# EAGLE design LispStar (EAGLE 7.6.0)

## Sheet 1 of 2
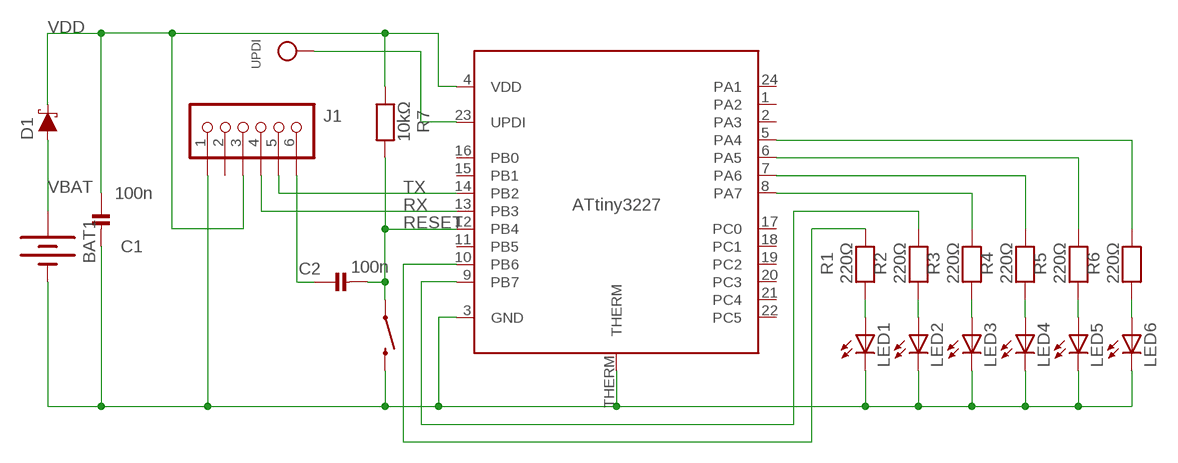
[diagram p0: schematic, sheet 1]

### Parts
BAT1  BATTERY12MM  [BATTCON_12MM]
C1  100n  CAP_CERAMIC_0805MP  [_0805MP]
C2  100n  CAP_CERAMIC_0805MP  [_0805MP]
D1  3A/10V/280mV  DIODE-SCHOTTKY-BAT60A  [SOD-323]
J1  AVR_SPI_PRG_6LINETESTPOINTS  [2X3_TEST_POINTS]
LED1  LEDCHIPLED_0805  [CHIPLED_0805]
LED2  LEDCHIPLED_0805  [CHIPLED_0805]
LED3  LEDCHIPLED_0805  [CHIPLED_0805]
LED4  LEDCHIPLED_0805  [CHIPLED_0805]
LED5  LEDCHIPLED_0805  [CHIPLED_0805]
LED6  LEDCHIPLED_0805  [CHIPLED_0805]
R1  220Ω  RESISTOR_0805MP  [_0805MP]
R2  220Ω  RESISTOR_0805MP  [_0805MP]
R3  220Ω  RESISTOR_0805MP  [_0805MP]
R4  220Ω  RESISTOR_0805MP  [_0805MP]
R5  220Ω  RESISTOR_0805MP  [_0805MP]
R6  220Ω  RESISTOR_0805MP  [_0805MP]
R7  10kΩ  RESISTOR_0805MP  [_0805MP]
S2  SWITCH-MOMENTARY-2SMD  [TACTILE-SWITCH-SMD]
U1  ATtiny3227  ATTINY3227  [QFN24_4MM]
UPDI  TESTPOINTROUND1MM  [TESTPOINT_ROUND_1MM]

### Nets
GND: BAT1.GND(-) C1.2 J1.1 LED1.C LED2.C LED3.C LED4.C LED5.C LED6.C S2.3 U1.3(GND) U1.THERM
N$2: U1.23(UPDI) UPDI.P$1
N$3: LED2.A R2.1
N$4: LED1.A R1.1
N$5: LED3.A R3.1
N$8: C2.1 J1.6
N$9: LED4.A R4.1
N$11: LED5.A R5.1
N$12: LED6.A R6.1
N$15: R6.2 U1.5(PA4)
N$16: R5.2 U1.6(PA5)
N$17: R4.2 U1.7(PA6)
N$18: R3.2 U1.8(PA7)
N$19: R2.2 U1.9(PB7)
N$20: R1.2 U1.10(PB6)
RESET: C2.2 R7.1 S2.1 U1.12(PB4)
RX: J1.4 U1.13(PB3)
TX: J1.5 U1.14(PB2)
VBAT: BAT1.PWR@1(+) D1.A
VDD: C1.1 D1.C J1.3 R7.2 U1.4(VDD)
Unconnected: J1.2 U1.1(PA2) U1.2(PA3) U1.11(PB5) U1.15(PB1) U1.16(PB0) U1.17(PC0) U1.18(PC1) U1.19(PC2) U1.20(PC3) U1.21(PC4) U1.22(PC5) U1.24(PA1)

## Sheet 2 of 2

## Library data of the parts
BAT1 = SparkFun-Electromechanical:BATTERY: Battery Holders Various common sizes : AA, AAA, 18650 (PRT-12895), 20mm coin cell and 12mm coin cell. 20MM_4LEGS, BATT-10373; PROD_ID: BATT-08044
C1 C2 = microbuilder:CAP_CERAMIC: Ceramic Capacitors 0402 - 0402 Surface Mount Capacitors 16pF 50V 5% [Digikey: 445-4899-2-ND] 18pF 50V 5% [Digikey: 490-1281-2-ND] 22pF 50V 5% [Digikey: 490-1283-2-ND] 68pF 50V 5% [Digikey: 490-1289-2-ND] 0.1uF 10V 10% [Digikey: 490-1318-2-ND] 1.0uF 6.3V 10% [Digikey: 490-1320-2-ND] 0603 - 0603 Surface Mount Capacitors 16 pF 50V 5% [Digikey: 445-5051-2-ND] 22 pF 50V [Digikey: PCC220ACVTR-ND] 33 pF 50V 5% [Digikey: 490-1415-1-ND] 56pF 50V 5% [Digikey: 490-1421-1-ND] 220pF 50V 5% [Digikey: 445-1285-1-ND] 680 pF 50V 2200 pF 50V 5% C0G [Digikey: 445-1297-1-ND] 5600 pF 100V 5% X7R [Digikey: 478-3711-1-ND] 0.1 µF 25V 10% [Digikey: PCC2277TR-ND] 0.22 µF 16V 10% X7R [Digikey: 445-1318-1-ND] 1.0 µF 25V 10% [Digikey: 445-5146-2-ND] 0603 - RF Specific 3pF 250V +/-0.1pF RF [Digikey: 712-1347-1-ND] 18 pF 250V 5% [Digikey: 478-3505-1-ND or 712-1322-1-ND] 56 pF 250V 5% C0G RF [Digikey: 490-4867-1-ND] 68 pF 250V RF [Digikey: 490-4868-1-ND] 0805 - 0805 Surface Mount Capacitors 220 pF 250V 2% RF Ceramic Capacitor [Digikey: 712-1398-1-ND] 1000 pF 50V 2% NP0 Ceramic Capacitor [Digikey: 478-3760-1-ND] 0.1 µF 25V 10% Ceramic Capacitor [Digikey: PCC1828TR-ND] 1.0 µF 16V 10% Ceramic Capacitor[Digikey: 490-1691-2-ND] 10.0 µF 10V 10% Ceramic Capacitor[Digikey: 709-1228-1-ND] 10.0 uF 16V 10% Ceramic Capacitor [Digikey: 478-5165-2-ND] 47 uF 6.3V 20% Ceramic Capacitor [Digikey: 587-1779-1-ND or 399-5506-1-ND] 1206 - 1206 Surface Mount Capacitors 47uF 10V 20% Ceramic Capacitor [Digikey: 490-5528-1-ND or 399-5508-1-ND or 445-6010-1-ND] 100uF 6.3V -20%, +80% Y5V Ceramic Capacitor (Digikey: 490-4512-1-ND, Mouser: 81-GRM31CF50J107ZE1L)
D1 = SparkFun-DiscreteSemi:DIODE-SCHOTTKY: Schottky diode A Schottky diode is a semiconductor diode which has a low forward voltage drop and a very fast switching action.; PROD_ID: DIO-14072
J1 = technoblogy:AVR_SPI_PRG_6LINE: AVR ISP 6 Pin This is the reduced ISP connector for AVR programming. Common on Arduino. This footprint will take up less PCB space and can be used with a 10-pin to 6-pin adapter such as SKU: BOB-08508 **Special note about "TEST_POINT" package. The stop mask is on the top side, so if you want your programming test points to be on the bottom of your board, make sure to place this package on the bottom side of the board. This also ensure that the orientation to program from the bottom side will be correct.
LED1-LED6 = adafruit:LED: LED OSRAM: - CHIPLED LG R971, LG N971, LY N971, LG Q971, LY Q971, LO R971, LY R971 LH N974, LH R974 LS Q976, LO Q976, LY Q976 LO Q996 - Hyper CHIPLED LW Q18S LB Q993, LB Q99A, LB R99A - SideLED LS A670, LO A670, LY A670, LG A670, LP A670 LB A673, LV A673, LT A673, LW A673 LH A674 LY A675 LS A676, LA A676, LO A676, LY A676, LW A676 LS A679, LY A679, LG A679 - Hyper Micro SIDELED® LS Y876, LA Y876, LO Y876, LY Y876 LT Y87S - SmartLED LW L88C, LW L88S LB L89C, LB L89S, LG L890 LS L89K, LO L89K, LY L89K LS L896, LA L896, LO L896, LY L896 - TOPLED LS T670, LO T670, LY T670, LG T670, LP T670 LSG T670, LSP T670, LSY T670, LOP T670, LYG T670 LG T671, LOG T671, LSG T671 LB T673, LV T673, LT T673, LW T673 LH T674 LS T676, LA T676, LO T676, LY T676, LB T676, LH T676, LSB T676, LW T676 LB T67C, LV T67C, LT T67C, LS T67K, LO T67K, LY T67K, LW E67C LS E67B, LA E67B, LO E67B, LY E67B, LB E67C, LV E67C, LT E67C LW T67C LS T679, LY T679, LG T679 LS T770, LO T770, LY T770, LG T770, LP T770 LB T773, LV T773, LT T773, LW T773 LH T774 LS E675, LA E675, LY E675, LS T675 LS T776, LA T776, LO T776, LY T776, LB T776 LHGB T686 LT T68C, LB T68C - Hyper Mini TOPLED® LB M676 - Mini TOPLED Santana® LG M470 LS M47K, LO M47K, LY M47K Source: http://www.osram.convergy.de/
R1-R7 = microbuilder:RESISTOR: Resistors 0402 - 0402 Surface Mount Package 22 Ohm 1% 1/16W [Digikey: 311-22.0LRTR-ND] 33 Ohm 5% 1/16W 1.0K 5% 1/16W 1.5K 5% 1/16W 2.0K 1% 1/16W 10.0K 1% 1/16W [Digikey: 311-10.0KLRTR-ND] 10.0K 5% 1/16W [Digikey: RMCF0402JT10K0TR-ND] 12.1K 1% 1/16W [Digikey: 311-22.0LRTR-ND] 100.0K 5% 1/16W 0603 - 0603 Surface Mount Package 0 Ohm 1/10 Watt 1% Resistor 15 Ohm 1/10 Watt 1% Resistor 33 Ohm 1/10 Watt 1% Resistor 49.9 Ohm 1/10 Watt 1% Resistor 100 Ohm 1/10 Watt 1% Resistor 150 Ohm 1/10 Watt 1% Resistor 240 Ohm 1/10 Watt 1% Resistor 390 Ohm 1/10 Watt 1% Resistor 560 Ohm 1/10 Watt 1% Resistor 680 Ohm 1/10 Watt 1% Resistor 750 Ohm 1/10 Watt 1% Resistor 1.0K Ohm 1/10 Watt 1% Resistor 1.5K Ohm 1/10 Watt 1% Resistor 2.0K Ohm 1/10 Watt 1% Resistor 2.2K Ohm 1/10 Watt 1% Resistor 3.3K Ohm 1/10 Watt 1% Resistor 4.7K Ohm 1/10 Watt 1% Resistor 10.0K Ohm 1/10 Watt 1% Resistor 12.0K Ohm 1/10 Watt 1% Resistor 12.1K Ohm 1/10 Watt 1% Resistor 20.0K Ohm 1/10 Watt 1% Resistor 33.0K Ohm 1/10 Watt 1% Resistor 100.0K Ohm 1/10 Watt 1% Resistor 0805 - 0805 Surface Mount Package 0 Ohm 1/8 Watt 1% Resistor 33 Ohm 1/8 Watt 1% Resistor 100 Ohm 1/8 Watt 1% Resistor 150 Ohm 1/8 Watt 1% Resistor 200 Ohm 1/8 Watt 1% Resistor 240 Ohm 1/8 Watt 1% Resistor 330 Ohm 1/8 Watt 1% Resistor 390 Ohm 1/8 Watt 1% Resistor 470 Ohm 1/8 Watt 1% Resistor 1.0K Ohm 1/8 Watt 1% Resistor 1.5K Ohm 1/8 Watt 1% Resistor 2.0K Ohm 1/8 Watt 1% Resistor 4.7K Ohm 1/8 Watt 1% Resistor 5.1K Ohm 1/8 Watt 1% Resistor 5.6K Ohm 1/8 Watt 1% Resistor 10.0K Ohm 1/8 Watt 1% Resistor 22.0K Ohm 1/8 Watt 1% Resistor 33.0K Ohm 1/8 Watt 1% Resistor 100K Ohm 1/8 Watt 1% Resistor 1206 - 1206 Surface Mount Package 2012 - 2010 Surface Mount Package 0.11 Ohm 1/2 Watt 1% Resistor - Digikey: RHM.11UCT-ND
S2 = SparkFun-Electromechanical:SWITCH-MOMENTARY-2: Various NO switches- pushbuttons, reed, etc; PROD_ID: SWCH-08247
U1 = technoblogy:ATTINY3227: ATtiny3227
UPDI = microbuilder:TESTPOINT: Test Point Various test points for characterisation and PCB testing TESTPOINT_SMT - Compact Surface Mount Test Point [Digikey: 5016KTR-ND]

## Net classes
0 default: width 0.152 mm, drill 0.305 mm, clearance 0.152 mm

## Board
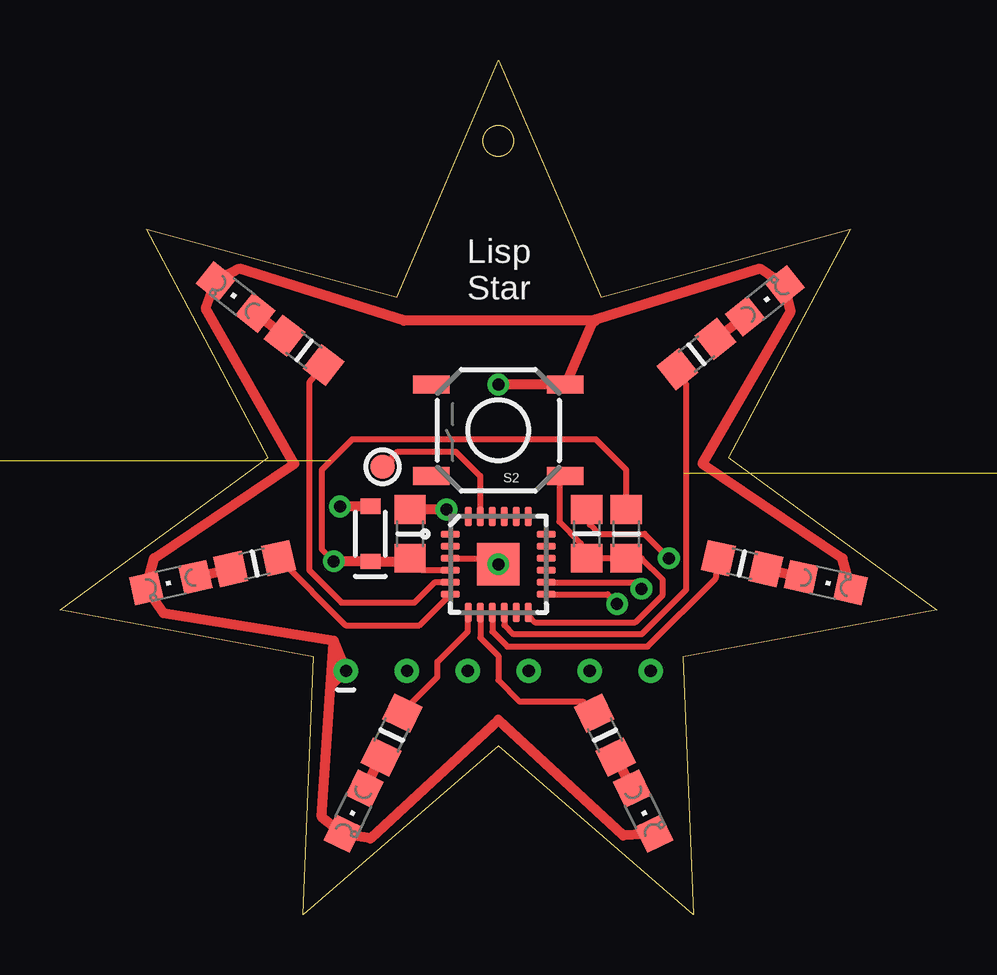
[diagram p1: board, top side]
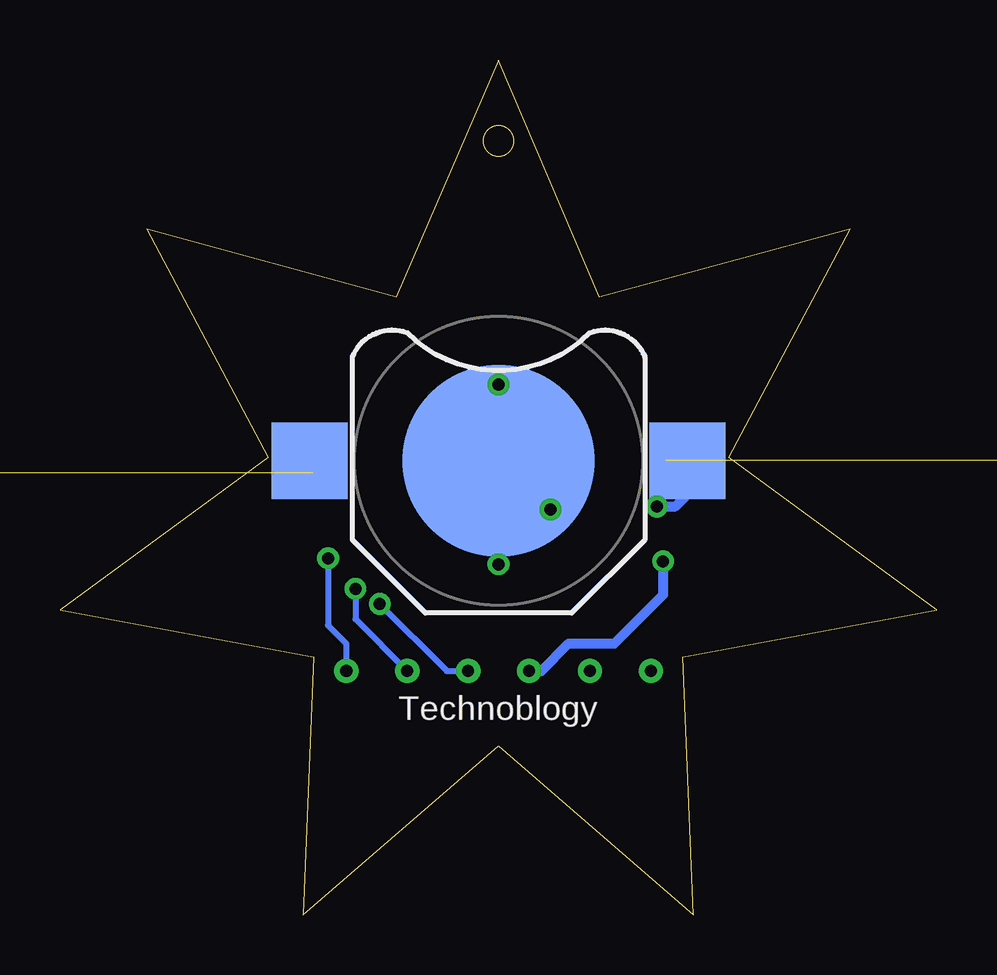
[diagram p2: board, bottom side, seen from below]

Size 36.56 x 35.64 mm. Coordinates in mm from the lower left corner, seen from the top.
Outline: 10.14,0 10.58,10.75 0,12.72 8.68,19.08 3.62,28.58 14.06,25.75 18.28,35.64 22.55,25.75 32.94,28.58 27.87,19.08 36.56,12.72 25.98,10.75 26.42,0 18.27,7.04 10.14,0
Outline: circle at 18.27,32.27 radius 0.64
Copper layers (1*16): Top 0.035mm / dielectric 1.5mm / Bottom 0.035mm
Design rules "default *": minimum track width 10mil, minimum drill 24mil, track to track 8mil, track to pad 8mil, pad to pad 8mil, via to via 8mil, smd to smd 8mil, copper to edge 40mil, drill to drill 8mil, minimum pad ring 10mil, minimum via ring 8mil, stop-mask expansion 4mil, vias tented up to drill 20mil, thermal gap 10mil

### Footprints (pad centres in the part's own frame; a part is rotated, then mirrored left to right if it is on the bottom)
BATTCON_12MM = smd 8 x 8: GND 0,0 | smd 3.175 x 3.175: PWR@1 -7.874,0; PWR@2 7.874,0
_0805MP = smd 1.2 x 1.3: 1 -1.016,0; 2 1.016,0
SOD-323 = smd 0.63 x 0.83: A 1.15,0; C -1.15,0
2X3_TEST_POINTS = drill 0.508: 1 -6.35,0; 2 -3.81,0; 3 -1.27,0; 4 1.27,0; 5 3.81,0; 6 6.35,0
CHIPLED_0805 = smd 1.2 x 1.2: A 0,-1.05; C 0,1.05
TACTILE-SWITCH-SMD = smd 1.524 x 0.762: 1 -2.794,1.905; 2 2.794,1.905; 3 -2.794,-1.905; 4 2.794,-1.905
QFN24_4MM = smd 0.8 x 0.28: 1 -2,1.25; 2 -2,0.75; 3 -2,0.25; 4 -2,-0.25; 5 -2,-0.75; 6 -2,-1.25; 13 2,-1.25; 14 2,-0.75; 15 2,-0.25; 16 2,0.25; 17 2,0.75; 18 2,1.25 | smd 0.28 x 0.8: 7 -1.25,-2; 8 -0.75,-2; 9 -0.25,-2; 10 0.25,-2; 11 0.75,-2; 12 1.25,-2; 19 1.25,2; 20 0.75,2; 21 0.25,2; 22 -0.25,2; 23 -0.75,2; 24 -1.25,2 | smd 1.778 x 1.778: THERM 0,0
TESTPOINT_ROUND_1MM = smd 1 x 1: P$1 0,0

### Placement (x,y rotation side)
BAT1  18.27,18.94 0 bottom
C1  14.59,15.89 90 top
C2  21.96,15.89 270 top
D1  12.94,15.89 90 top
J1  18.27,10.17 0 top
LED1  29.39,25.6 308.5 top
LED2  31.93,13.86 257.2 top
LED3  24.31,4.33 205.8 top
LED4  12.24,4.33 154.2 top
LED5  4.62,13.86 102.8 top
LED6  7.32,25.76 51.4 top
R1  26.53,23.38 218.5 top
R2  28.43,14.65 167.2 top
R3  22.72,7.51 115.8 top
R4  13.83,7.51 64.2 top
R5  8.11,14.65 12.8 top
R6  10.18,23.54 322.5 top
R7  23.61,15.89 90 top
S2  18.27,20.21 180 top
U1  18.27,14.62 0 top
UPDI  13.45,18.68 0 top

### Tracks (layer width: path | path; a pad name or v marks a point on that pad's centre or on a via)
GND  (via drill 0.5)
  Top 0.178: 18.64,14.22 U1.THERM | 11.5,10.3 11.33,10.13
  Top 0.254: U1.3 17.52,14.87 17.64,14.74 | 17.64,14.74 17.89,14.74 18.27,15.13 | 17.64,13.86 18.27,14.49 U1.THERM 17.77,14.62 17.64,14.74
  Top 0.406: 11.29,9.55 10.91,4.08 LED4.C 12.94,3.19 18.27,8.14 23.48,3.31 LED3.C | 11.29,9.55 11.33,10.13 11.42,11.32 | v16.11,16.9 C1.2 | 22.34,24.78 22.21,24.78 | 22.21,24.78 14.34,24.78 7.48,26.94 LED6.C 6.08,25.29 9.76,18.81 3.92,14.87 LED5.C 4.3,12.59 11.42,11.44 J1.1 11.29,9.55 | 22.21,24.78 29.2,26.94 LED1.C 30.47,25.16 26.78,18.81 32.62,14.87 LED2.C | 22.21,24.78 S2.3 v18.27,22.11
  Bottom 0.178: v18.27,22.11 BAT1.GND
  Bottom 0.254: 16.5,15.51 v16.11,16.9
  Bottom 0.406: U1.THERM 18.27,16.4 | 18.27,16.4 BAT1.GND | 18.27,16.4 16.11,16.4 v16.11,16.9
  other vias: 18.27,14.62
N$2
  Top 0.254: U1.23 17.51,16.63 17.51,18.3 16.5,19.32 14.08,19.32 13.83,19.06 13.83,18.94 13.57,18.68 UPDI.P$1
N$3
  Top 0.406: R2.1 LED2.A
N$4
  Top 0.406: LED1.A R1.1
N$5
  Top 0.406: R3.1 LED3.A
N$8  (via drill 0.5)
  Top 0.254: v25.39,14.87 24.37,15.89 22.46,15.89 22.08,16.27 C2.1
  Bottom 0.254: v25.39,14.87 25.39,12.08 24.62,11.32 J1.6
N$9
  Top 0.406: R4.1 LED4.A
N$11
  Top 0.406: LED5.A R5.1
N$12
  Top 0.406: LED6.A R6.1
N$15
  Top 0.178: 10.65,23.25 R6.2
  Top 0.254: U1.5 15.61,13.86 14.77,13.02 11.74,13.02 10.4,14.36 10.4,22.21 R6.2
N$16
  Top 0.254: R5.2 11.9,12.08 14.98,12.08 U1.6
N$17
  Top 0.254: R4.2 14.27,8.46 15.73,9.92 15.73,10.55 17,11.82 17,12.6 U1.7
N$18
  Top 0.254: U1.8 17.52,11.56 18.27,10.81 18.27,9.79 19.16,8.9 21.79,8.9 R3.2
N$19
  Top 0.254: R2.2 27.32,14.01 24.5,11.19 18.65,11.19 18.02,11.82 U1.9
N$20
  Top 0.254: U1.10 18.52,12.08 18.91,11.7 24.24,11.7 26.11,13.57 26.11,22.11 R1.2
RESET
  Top 0.254: U1.12 19.52,12.48 19.8,12.2 23.99,12.2 25.13,13.35 25.13,13.98 24.24,14.87 R7.1 C2.2 21.7,15.13 21.7,15.51 20.81,16.4 20.81,18.3 S2.1
RX  (via drill 0.5)
  Top 0.254: v23.23,12.97 22.83,13.37 U1.13
  Bottom 0.254: v23.23,12.97 20.43,10.17 J1.4
TX  (via drill 0.5)
  Top 0.254: U1.14 23.98,13.87 v24.24,13.6
  Bottom 0.254: v24.24,13.6 24.24,12.33 J1.5
VBAT  (via drill 0.5)  (5 unrouted)
  Top 0.406: D1.A 11.55,17.04 v11.67,17.03
  Bottom 0.406: 25.89,19.57 BAT1.PWR@1 26.02,18.43 | 10.4,17.54 10.91,17.03 v11.67,17.03 11.67,17.67 11.29,17.67 11.29,18.94
VDD  (via drill 0.5)
  Top 0.254: R7.2 23.61,18.55 22.34,19.82 12.18,19.82 10.91,18.55 10.91,15.25 v11.42,14.74 | U1.4 15.09,14.37 C1.1
  Top 0.406: v11.42,14.74 D1.C 14.46,14.74 C1.1
  Bottom 0.406: J1.3 16.5,10.17 15.35,11.32 13.45,11.32 11.42,13.35 v11.42,14.74

### Text on the board
tPlace: Lisp / Star
bPlace: Technoblogy